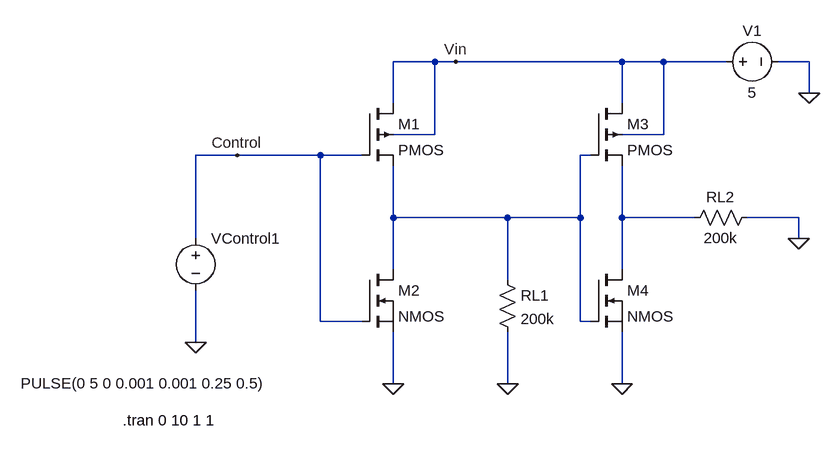
[diagram p0: schematic Project2Sw2.asc]
Project2Sw2.asc, the LTspice schematic file:
Version 4
SHEET 1 884 680
WIRE 288 -128 224 -128
WIRE 320 -128 288 -128
WIRE 576 -128 320 -128
WIRE 640 -128 576 -128
WIRE 736 -128 640 -128
WIRE 864 -128 816 -128
WIRE 864 -80 864 -128
WIRE 224 -64 224 -128
WIRE 576 -64 576 -128
WIRE 288 -16 288 -128
WIRE 288 -16 224 -16
WIRE 640 -16 640 -128
WIRE 640 -16 576 -16
WIRE -16 16 -80 16
WIRE 112 16 -16 16
WIRE 176 16 112 16
WIRE 528 16 512 16
WIRE 224 112 224 32
WIRE 400 112 224 112
WIRE 512 112 512 16
WIRE 512 112 400 112
WIRE 576 112 576 32
WIRE 688 112 576 112
WIRE 848 112 768 112
WIRE -80 144 -80 16
WIRE 848 144 848 112
WIRE 224 192 224 112
WIRE 576 192 576 112
WIRE 400 208 400 112
WIRE 112 272 112 16
WIRE 176 272 112 272
WIRE 512 272 512 112
WIRE 528 272 512 272
WIRE -80 304 -80 224
WIRE 224 368 224 288
WIRE 400 368 400 288
WIRE 576 368 576 288
FLAG -80 304 0
FLAG 320 -128 Vin
FLAG -16 16 Control
FLAG 224 368 0
FLAG 848 144 0
FLAG 576 368 0
FLAG 864 -80 0
FLAG 400 368 0
SYMBOL voltage -80 128 R0
WINDOW 3 -269 239 Left 2
WINDOW 123 0 0 Left 0
WINDOW 39 0 0 Left 0
SYMATTR InstName VControl1
SYMATTR Value PULSE(0 5 0 0.001 0.001 0.25 0.5)
SYMBOL voltage 720 -128 R270
WINDOW 0 32 56 VTop 2
WINDOW 3 -32 56 VBottom 2
SYMATTR InstName V1
SYMATTR Value 5
SYMBOL pmos4 176 -64 R0
SYMATTR InstName M1
SYMBOL nmos 176 192 R0
SYMATTR InstName M2
SYMBOL pmos4 528 -64 R0
SYMATTR InstName M3
SYMBOL nmos 528 192 R0
SYMATTR InstName M4
SYMBOL res 672 128 R270
WINDOW 0 32 56 VTop 2
WINDOW 3 0 56 VBottom 2
SYMATTR InstName RL2
SYMATTR Value 200k
SYMBOL res 384 192 R0
SYMATTR InstName RL1
SYMATTR Value 200k
TEXT -192 424 Left 2 !.tran 0 10 1 1

The netlist it stands for:
* Project2Sw2.asc
VControl1 Control 0 PULSE(0 5 0 0.001 0.001 0.25 0.5)
V1 Vin 0 5
M1 Vin Control N001 Vin PMOS
M2 N001 Control 0 0 NMOS
M3 Vin N001 N002 Vin PMOS
M4 N002 N001 0 0 NMOS
RL2 N002 0 200k
RL1 N001 0 200k
.model NMOS NMOS
.model PMOS PMOS
.lib standard.mos
.tran 0 10 1 1
.backanno
.end